# EAGLE design SimpleFMCWRadar-RFBoard (EAGLE 6.5.0)
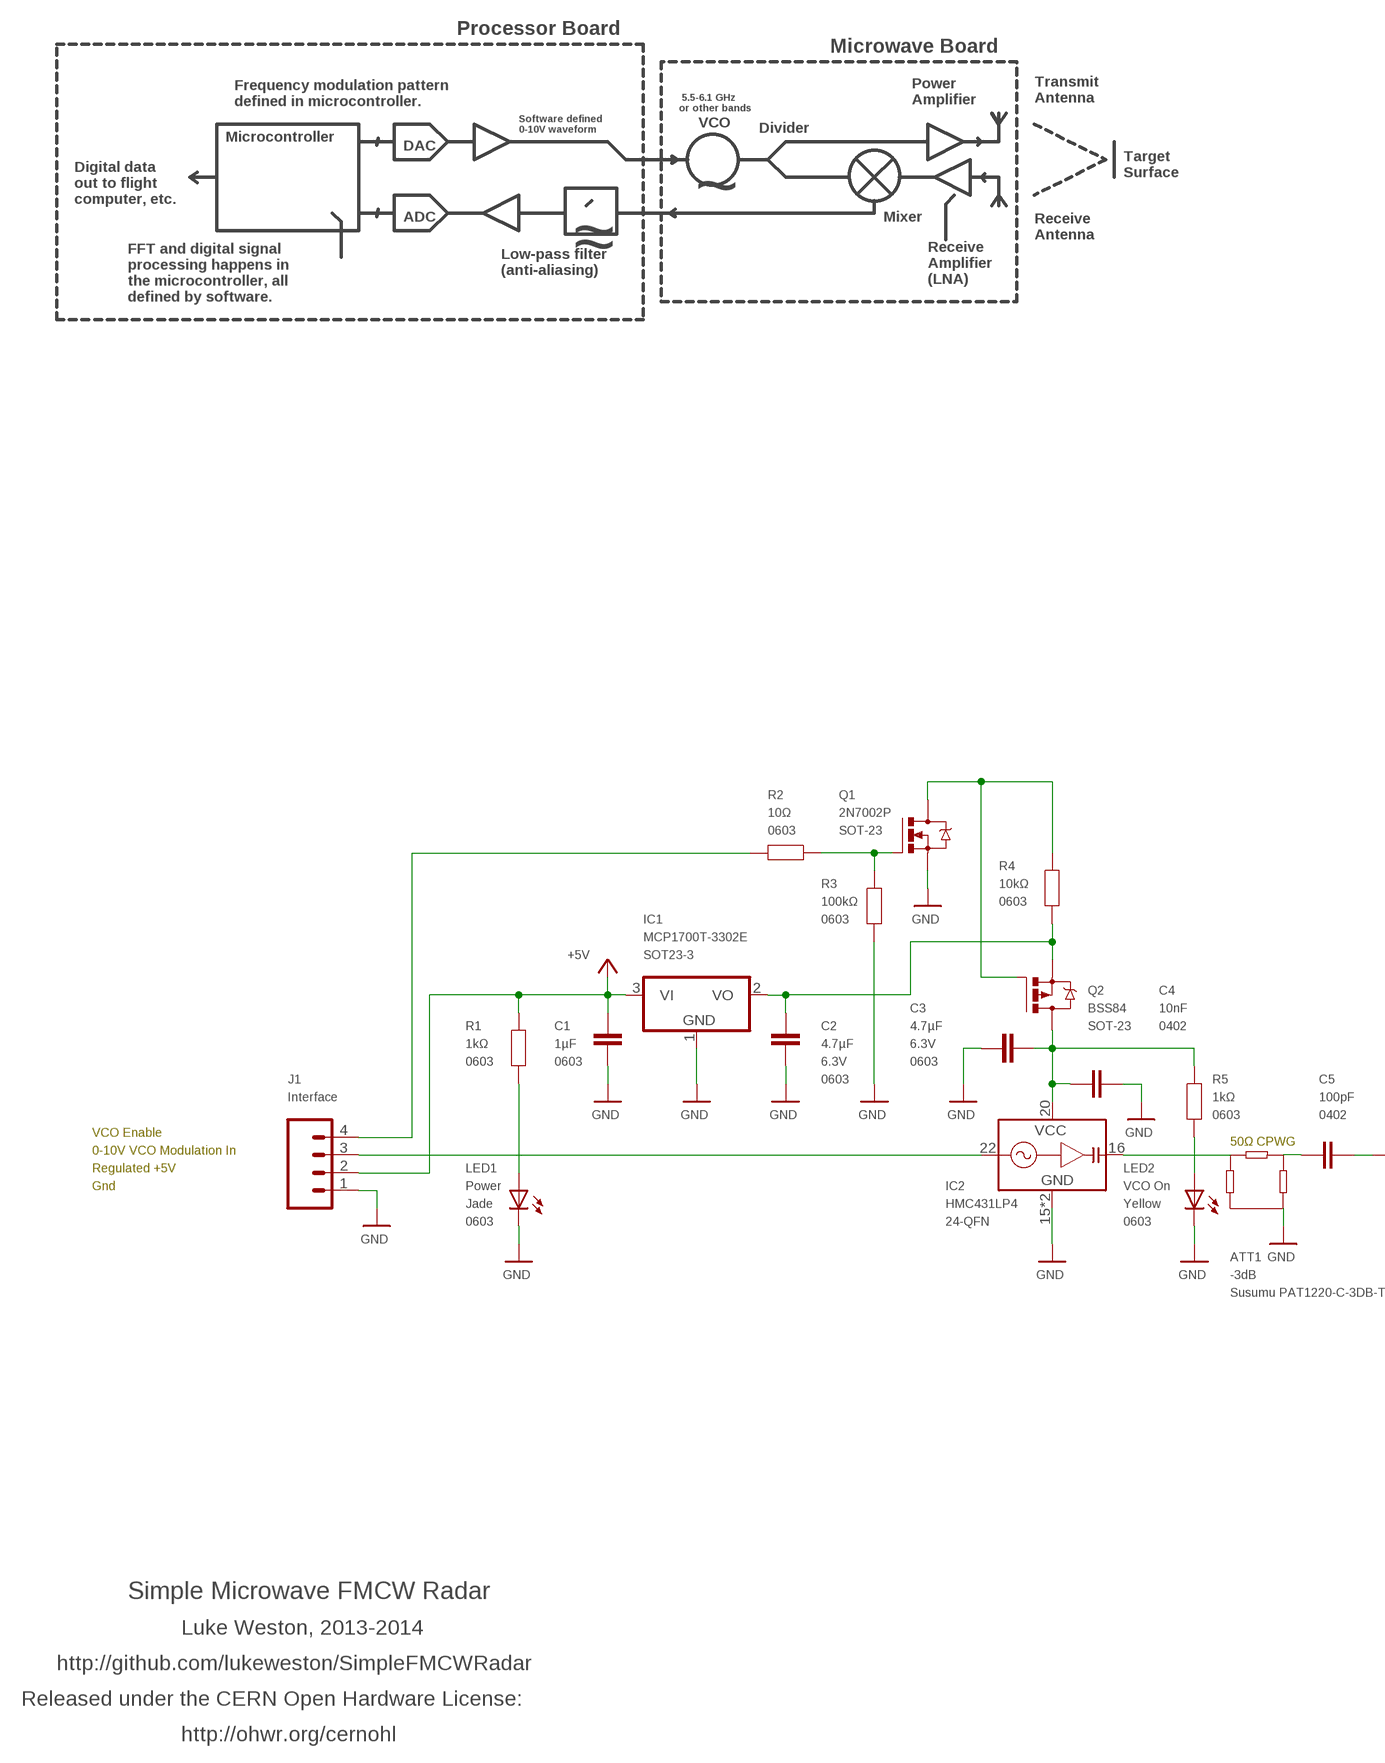
[diagram p0: schematic, sheet 1, part 1 of 2]
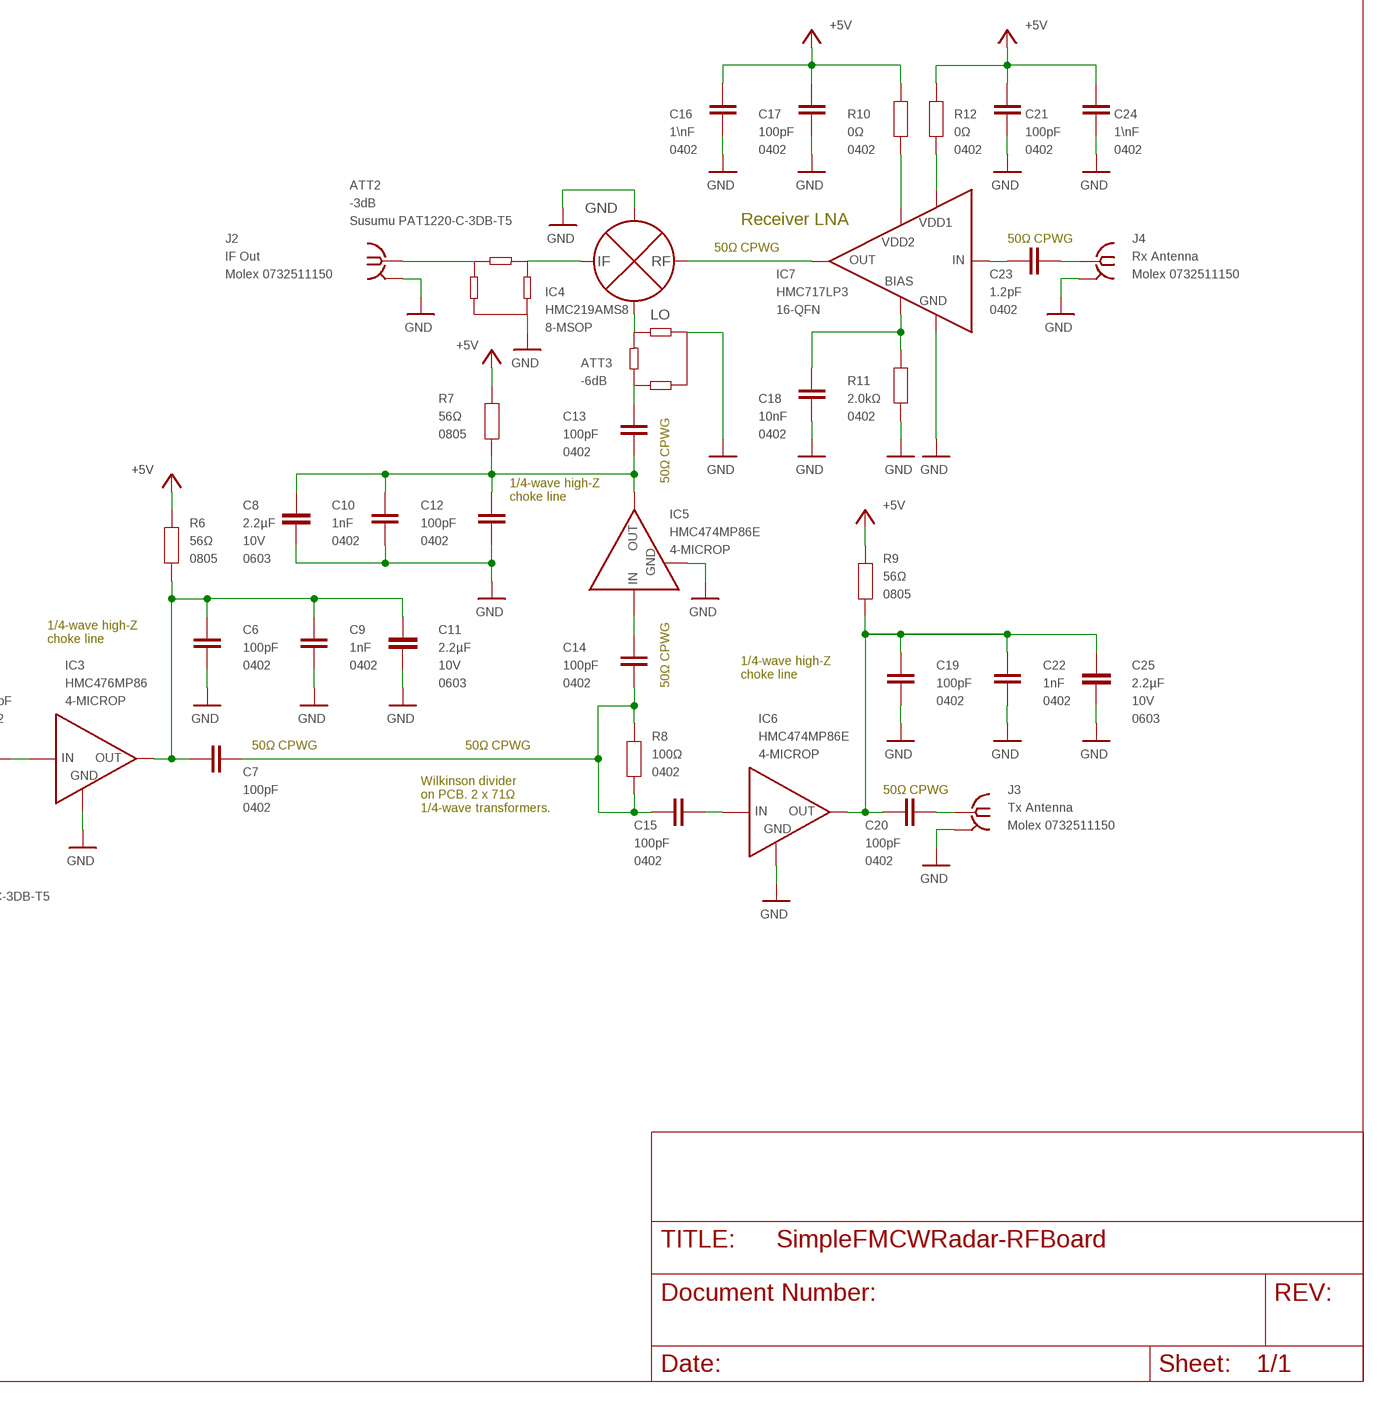
[diagram p1: schematic, sheet 1, part 2 of 2]

## Parts
ATT1  -3dB  PAT1220  [PAT1220]
ATT2  -3dB  PAT1220  [PAT1220]
ATT3  -6dB  PAT1220  [PAT1220]
C1  1µF  CAP0603  [0603]
C2  4.7µF  CAP0603  [0603]
C3  4.7µF  CAP0603  [0603]
C4  10nF  CAPACITOR0402  [0402]
C5  100pF  CAPACITOR0402  [0402]
C6  100pF  CAPACITOR0402  [0402]
C7  100pF  CAPACITOR0402  [0402]
C8  2.2µF  CAP0603  [0603]
C9  1nF  CAPACITOR0402  [0402]
C10  1nF  CAPACITOR0402  [0402]
C11  2.2µF  CAP0603  [0603]
C12  100pF  CAPACITOR0402  [0402]
C13  100pF  CAPACITOR0402  [0402]
C14  100pF  CAPACITOR0402  [0402]
C15  100pF  CAPACITOR0402  [0402]
C16  1\nF  CAPACITOR0402  [0402]
C17  100pF  CAPACITOR0402  [0402]
C18  10nF  CAPACITOR0402  [0402]
C19  100pF  CAPACITOR0402  [0402]
C20  100pF  CAPACITOR0402  [0402]
C21  100pF  CAPACITOR0402  [0402]
C22  1nF  CAPACITOR0402  [0402]
C23  1.2pF  CAPACITOR0402  [0402]
C24  1\nF  CAPACITOR0402  [0402]
C25  2.2µF  CAP0603  [0603]
IC1  MCP1700T-3302E  MCP1703CB  [SOT23]
IC2  HMC431LP4  HMC385LP4  [QFN24]
IC3  HMC476MP86  ERA-2SM+  [WW107]
IC4  HMC219AMS8  [8-MSOP]
IC5  HMC474MP86E  ERA-2SM+  [WW107]
IC6  HMC474MP86E  ERA-2SM+  [WW107]
IC7  HMC717LP3  [16-QFN]
J1  Interface  M04PTH  [1X04]
J2  IF Out  SMA-142-0701-881/886  [J502-ND-142-0701-881/886]
J3  Tx Antenna  SMA-142-0701-881/886  [J502-ND-142-0701-881/886]
J4  Rx Antenna  SMA-142-0701-881/886  [J502-ND-142-0701-881/886]
LED1  Power  LED0603  [LED-0603]
LED2  VCO On  LED0603  [LED-0603]
Q1  2N7002P  2N7002  [SOT23-3]
Q2  BSS84  DMP2035U-7  [SOT23-3]
R1  1kΩ  RESISTOR0603  [0603]
R2  10Ω  RESISTOR0603  [0603]
R3  100kΩ  RESISTOR0603  [0603]
R4  10kΩ  RESISTOR0603  [0603]
R5  1kΩ  RESISTOR0603  [0603]
R6  56Ω  RESISTOR0805  [0805]
R7  56Ω  RESISTOR0805  [0805]
R8  100Ω  RESISTOR-EU0402  [0402]
R9  56Ω  RESISTOR0805  [0805]
R10  0Ω  RESISTOR-EU0402  [0402]
R11  2.0kΩ  RESISTOR-EU0402  [0402]
R12  0Ω  RESISTOR-EU0402  [0402]

## Nets
+5V: C1.2 C16.2 C17.2 C21.2 C24.2 IC1.3(VI) J1.2 R1.2 R6.2 R7.1 R9.1 R10.2 R12.2
GND: ATT1.3 ATT2.3 ATT3.3 C1.1 C2.2 C3.2 C4.2 C6.1 C8.1 C9.1 C10.1 C11.1 C12.1 C16.1 C17.1 C18.1 C19.2 C21.1 C22.2 C24.1 C25.1 IC1.1(GND) IC2.15(GND) IC2.EXP(GND) IC3.2(GND) IC3.4(GND) IC4.1(GND) IC4.3(GND) IC4.6(GND) IC4.8(GND) IC5.2(GND) IC5.4(GND) IC6.2(GND) IC6.4(GND) IC7.P$1(GND) IC7.P$3(GND) IC7.P$4(GND) IC7.P$5(GND) IC7.P$6(GND) IC7.P$7(GND) IC7.P$9(GND) IC7.P$10(GND) IC7.P$12(GND) IC7.P$14(GND) IC7.P$16(GND) IC7.PAD(GND) J1.1 J2.G@1(GND) J3.G@1(GND) J4.G@1(GND) LED1.C LED2.C Q1.2(S) R3.1 R11.1
N$1: C5.2 IC3.1(IN)
N$2: C6.2 C7.1 C9.2 C11.2 IC3.3(OUT) R6.1
N$3: ATT1.2 C5.1
N$4: ATT1.1 IC2.16(RFOUT)
N$6: IC2.22(VTUNE) J1.3
N$7: C15.1 IC6.1(IN)
N$9: C7.2 C14.1 C15.2 R8.1 R8.2
N$10: C20.1 J3.1
N$12: ATT3.2 IC4.2(LO)
N$13: Q1.1(G) R2.1 R3.2
N$14: ATT2.2 IC4.5(IF)
N$15: C23.2 IC7.P$2(IN)
N$16: C23.1 J4.1
N$17: IC4.7(RF) IC7.P$11(OUT)
N$18: C18.2 IC7.P$8(BIAS) R11.2
N$19: IC7.P$13(VDD2) R10.1
N$20: IC7.P$15(VDD1) R12.1
N$21: LED1.A R1.1
N$25: ATT3.1 C13.2
N$27: C3.1 C4.1 IC2.20(VCC) Q2.3(D) R5.2
N$28: C2.1 IC1.2(VO) Q2.2(S) R4.1
N$29: Q1.3(D) Q2.1(G) R4.2
N$30: J1.4 R2.2
N$31: C19.1 C20.2 C22.1 C25.2 IC6.3(OUT) R9.2
N$32: LED2.A R5.1
N$33: C8.2 C10.2 C12.2 C13.1 IC5.3(OUT) R7.2
N$35: C14.2 IC5.1(IN)
N$36: ATT2.1 J2.1

## Notes on the sheet
- Processor Board
- Microwave Board
- Transmit
  Antenna
- Power
  Amplifier
- Frequency modulation pattern
  defined in microcontroller.
- 5.5-6.1 GHz
  or other bands
- VCO
- Software defined
  0-10V waveform
- Divider
- Microcontroller
- DAC
- Target
  Surface
- Digital data
  out to flight
  computer, etc.
- ~
- ADC | Mixer
- Receive
  Antenna
- ~ | ~
- Low-pass filter
  (anti-aliasing)
- Receive
  Amplifier
  (LNA)
- FFT and digital signal
  processing happens in
  the microcontroller, all
  defined by software.
- Receiver LNA
- 50Ω CPWG
- 50Ω CPWG
- 50Ω CPWG
- 1/4-wave high-Z
  choke line
- 1/4-wave high-Z
  choke line
- 1/4-wave high-Z
  choke line
- 50Ω CPWG
- VCO Enable
- 50Ω CPWG | 50Ω CPWG | 50Ω CPWG
- 0-10V VCO Modulation In
- Regulated +5V
- Gnd | 50Ω CPWG
- Wilkinson divider
  on PCB. 2 x 71Ω
  1/4-wave transformers.
- Simple Microwave FMCW Radar
- Luke Weston, 2013-2014
- http://github.com/lukeweston/SimpleFMCWRadar
- Released under the CERN Open Hardware License:
- http://ohwr.org/cernohl

## Power pins joined to a net without a drawn wire
GND: J2.G@2(GND) J2.G@3(GND) J2.G@4(GND) J3.G@2(GND) J3.G@3(GND) J3.G@4(GND) J4.G@2(GND) J4.G@3(GND) J4.G@4(GND)

## Library data of the parts
ATT1 ATT2 = freetronics-luke:PAT1220: Susumu PAT1220 SMD chip attenuator; ID: Susumu PAT1220-C-3DB-T5
ATT3 = freetronics-luke:PAT1220: Susumu PAT1220 SMD chip attenuator
C1 = freetronics-master-v1:CAP: Capacitor Standard 0603 ceramic capacitor, and 0.1" leaded capacitor.; PACKAGE: 0603
C2 C3 = freetronics-master-v1:CAP: Capacitor Standard 0603 ceramic capacitor, and 0.1" leaded capacitor.; PACKAGE: 0603; VOLTAGE: 6.3V
C4-C7 C9 C10 C12-C24 = freetronics-luke:CAPACITOR; PACKAGE: 0402
C8 C11 C25 = freetronics-master-v1:CAP: Capacitor Standard 0603 ceramic capacitor, and 0.1" leaded capacitor.; PACKAGE: 0603; VOLTAGE: 10V
IC1 = linear:MCP1703: 250 mA, 16V, Low Quiescent Current LDO Regulator Source: http://ww1.microchip.com/downloads/en/DeviceDoc/22049b.pdf; PACKAGE: SOT23-3
IC2 = microwave:HMC385LP4: MMIC VCO w/ BUFFER AMPLIFIER, 2.25 - 2.5 GHz Source: http://www.hittite.com/product_info/product_specs/vcos/hmc385lp4.pdf; OC_FARNELL: unknown; OC_NEWARK: unknown; PACKAGE: 24-QFN
IC3 IC5 IC6 = freetronics-luke:ERA-2SM+: Mini-Circuits ERA-2SM+ MMIC amplifier; PACKAGE: 4-MICROP
IC4 = freetronics-luke:HMC219AMS8: Hittite HMC219AMS8 double-balanced microwave mixer; PACKAGE: 8-MSOP
IC7 = freetronics-luke:HMC717LP3: Hittite HMC717LP3 6GHz LNA; PACKAGE: 16-QFN
J1 = freetronics-master-v1:M04: Header 4 Standard 4-pin 0.1" header. Use with straight break away headers (SKU : PRT-00116), right angle break away headers (PRT-00553), swiss pins (PRT-00743), machine pins (PRT-00117), and female headers (PRT-00115). Molex polarized connector foot print use with SKU : PRT-08231 with associated crimp pins and housings.
J2-J4 = con-coax:SMA-: SMA 50 Ohm End Launch Jack Receptacle - Round Contact Johnson Components Source: www.johnsoncomponents.com .. J502-ND.pdf; ID: Molex 0732511150; MF: JOHNSON COMPONENTS; MPN: 142-0701-881; OC_FARNELL: 1608603; OC_NEWARK: 08B906
LED1 = freetronics-master-v1:LED: LEDs Standard schematic elements and footprints for 5mm, 3mm, 1206, and 0603 sized LEDs. 5mm - Spark Fun Electronics SKU : COM-00529 (and others); COLOR: Jade; PACKAGE: 0603
LED2 = freetronics-master-v1:LED: LEDs Standard schematic elements and footprints for 5mm, 3mm, 1206, and 0603 sized LEDs. 5mm - Spark Fun Electronics SKU : COM-00529 (and others); COLOR: Yellow; PACKAGE: 0603
Q1 = freetronics-luke:2N7002: 2N7002 N-ch MOSFET in SOT-23.; PACKAGE: SOT-23
Q2 = freetronics-luke:DMP2035U-7: DMP2035U P-channel MOSFET in SOT-23.; PACKAGE: SOT-23
R1-R5 = freetronics-master-v1:RESISTOR: Resistor Basic schematic elements and footprints for 0603, 1206, and PTH 1/10th watt (small) resistors.; PACKAGE: 0603
R6 R7 R9 = freetronics-master-v1:RESISTOR: Resistor Basic schematic elements and footprints for 0603, 1206, and PTH 1/10th watt (small) resistors.; PACKAGE: 0805
R8 R10-R12 = freetronics-luke:RESISTOR-EU: Chip resistor, EU symbol; PACKAGE: 0402

## Net classes
1 vcc: width 0.254 mm

## Board
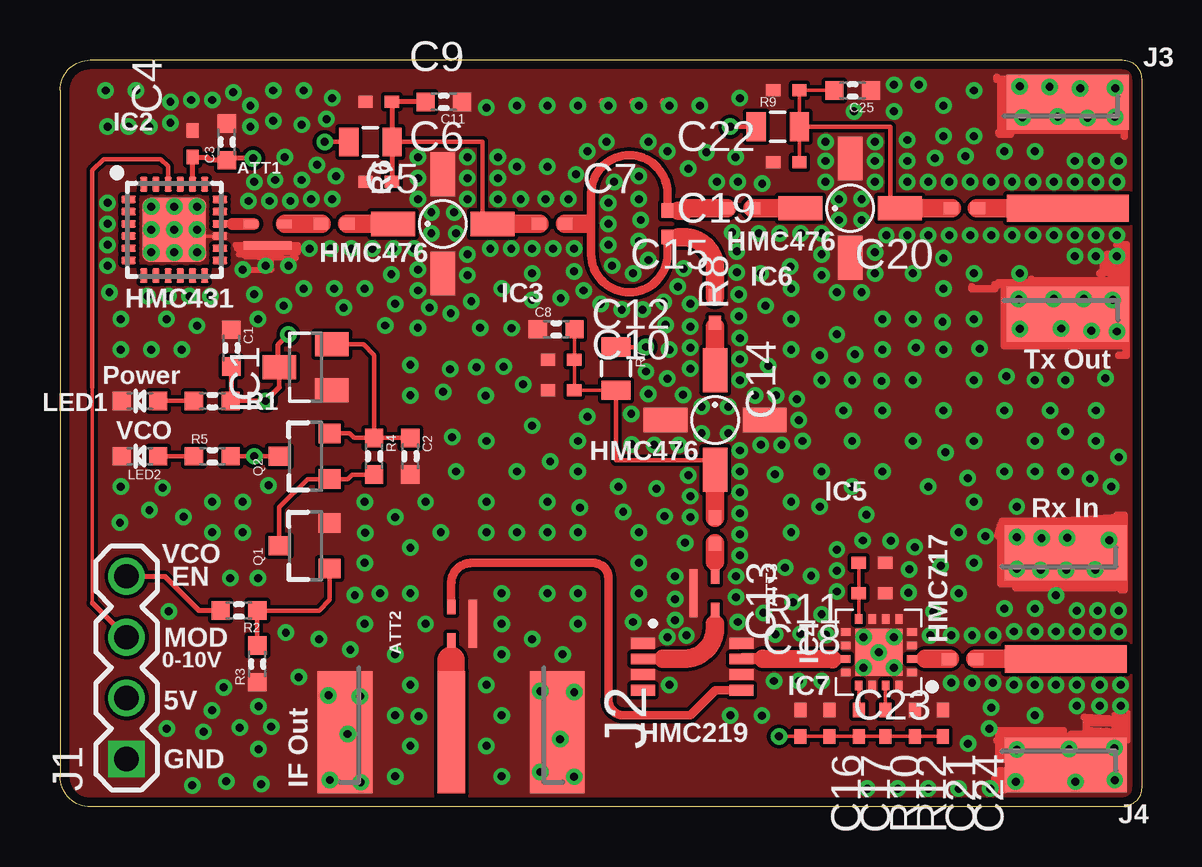
[diagram p2: board, top side]
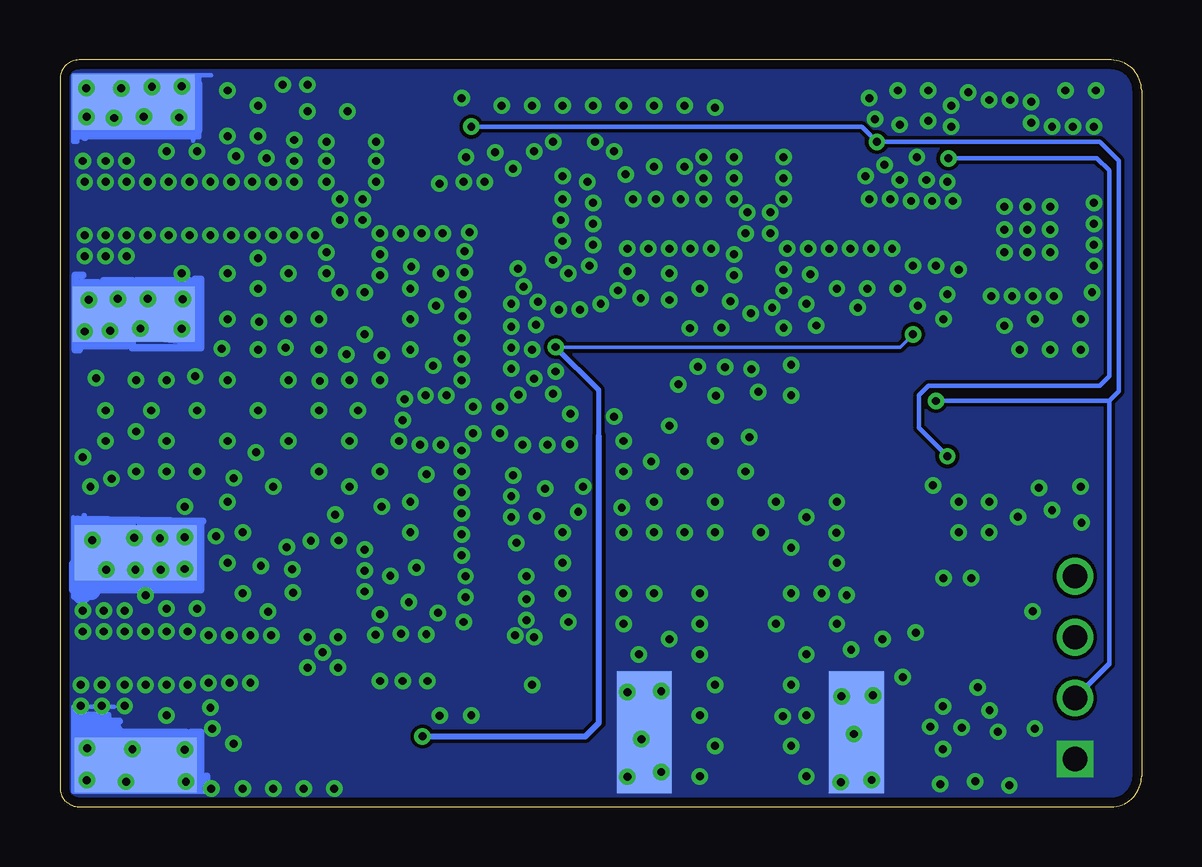
[diagram p3: board, bottom side, seen from below]

Size 45.09 x 31.11 mm. Coordinates in mm from the lower left corner, seen from the top.
Outline: 0,29.84 0,1.27 arc90 1.27,0 44.29,0 arc90 45.09,0.79 45.09,30.32 arc90 44.29,31.11 1.27,31.11 arc90 0,29.84
Copper layers (1*16): Top 0.0356mm / dielectric 1.5011mm / Bottom 0.0356mm
Design rules "LaenPCBOrder *": minimum track width 6mil, minimum drill 13mil, track to track 6mil, track to pad 6mil, pad to pad 6mil, via to via 6mil, smd to smd 6mil, copper to edge 15mil, drill to drill 6mil, minimum pad ring 7mil, minimum via ring 7mil, stop-mask expansion 4mil, vias tented up to drill 16mil, thermal gap 10mil

### Footprints (pad centres in the part's own frame; a part is rotated, then mirrored left to right if it is on the bottom)
PAT1220 = smd 0.6 x 0.35: 1 -0.7,0.45; 2 0.7,0.45 | smd 2 x 0.35: 3 0,-0.45
0603 = smd 0.762 x 0.762: 1 -0.762,0; 2 0.762,0
0402 = smd 0.6 x 0.5: 1 -0.55,0; 2 0.55,0
SOT23 = smd 1 x 1.4: 1 -0.95,-1.1; 2 0.95,-1.1; 3 0,1.1
QFN24 = smd 0.6 x 0.3: 1 -1.905,1.27; 2 -1.905,0.762; 3 -1.905,0.254; 4 -1.905,-0.254; 5 -1.905,-0.762; 6 -1.905,-1.27; 13 1.905,-1.27; 14 1.905,-0.762; 15 1.905,-0.254; 16 1.905,0.254; 17 1.905,0.762; 18 1.905,1.27 | smd 0.3 x 0.6: 7 -1.27,-1.905; 8 -0.762,-1.905; 9 -0.254,-1.905; 10 0.254,-1.905; 11 0.762,-1.905; 12 1.27,-1.905; 19 1.27,1.905; 20 0.762,1.905; 21 0.254,1.905; 22 -0.254,1.905; 23 -0.762,1.905; 24 -1.27,1.905 | smd 2.667 x 2.667: EXP 0,0
WW107 = smd 1.016 x 1.829: 1 0,-2.07; 3 0,2.07 | smd 1.829 x 1.016: 2 2.07,0; 4 -2.07,0
8-MSOP = smd 0.45 x 1: 1 -0.975,-2.05; 2 -0.325,-2.05; 3 0.325,-2.05; 4 0.975,-2.05; 5 0.975,2.05; 6 0.325,2.05; 7 -0.325,2.05; 8 -0.975,2.05
16-QFN = smd 0.305 x 0.406: P$1 -0.838,-1.384; P$2 -0.279,-1.384; P$3 0.279,-1.384; P$4 0.838,-1.384; P$9 0.838,1.384; P$10 0.279,1.384; P$11 -0.279,1.384; P$12 -0.838,1.384 | smd 0.406 x 0.305: P$5 1.384,-0.838; P$6 1.384,-0.279; P$7 1.384,0.279; P$8 1.384,0.838; P$13 -1.384,0.838; P$14 -1.384,0.279; P$15 -1.384,-0.279; P$16 -1.384,-0.838 | smd 1.956 x 1.956: PAD 0,0
1X04 = drill 1.016 square: 1 0,0 | drill 1.016: 2 2.54,0; 3 5.08,0; 4 7.62,0
J502-ND-142-0701-881/886 = smd 5.08 x 1.143: 1 2.565,0 | smd 5.08 x 2.286: G@1 2.565,4.42; G@2 2.565,-4.42 | smd 5.08 x 2.286 bottom: G@3 2.565,4.42; G@4 2.565,-4.42
LED-0603 = smd 0.762 x 0.762: A -0.762,0; C 0.762,0
SOT23-3 = smd 0.8 x 0.9: 1 -0.95,-1; 2 0.95,-1; 3 0,1.1
0805 = smd 0.8 x 1.2: 1 -0.9,0; 2 0.9,0

### Placement (x,y rotation side)
ATT1  8.65,23.84 0 top
ATT2  16.76,7.62 90 top
ATT3  26.86,8.89 270 top
C1  7.14,19.11 270 top
C2  14.61,14.61 270 top
C3  6.95,27.7 90 top
C4  5.52,27.62 90 top
C5  11.43,24.29 0 top
C6  13.29,26.04 0 top
C7  20.52,24.29 0 top
C8  20.68,19.9 0 top
C9  13.29,29.37 0 top
C10  20.9,17.36 0 top
C11  16,29.37 180 top
C12  20.9,18.63 0 top
C13  27.3,11.51 270 top
C14  27.3,20.72 270 top
C15  28.34,24.94 180 top
C16  30.86,3.48 270 top
C17  32.08,3.48 270 top
C18  33.84,8.89 180 top
C19  30.27,26.86 180 top
C20  37.7,24.94 180 top
C21  35.64,3.48 270 top
C22  30.27,29.84 180 top
C23  37.62,6.16 180 top
C24  36.8,3.48 270 top
C25  33.04,29.84 180 top
IC1  10.24,18.31 90 top
IC2  4.76,24.03 0 top
IC3  15.95,24.29 270 top
IC4  26.35,5.83 270 top
IC5  27.3,16.11 180 top
IC6  32.94,24.94 270 top
IC7  34.13,6.44 90 top
J1  2.78,1.98 90 top
J2  16.31,5.68 270 top
J3  39.45,24.94 0 top
J4  39.37,6.16 0 top
LED1  3.33,16.91 180 top
LED2  3.33,14.61 180 top
Q1  10.24,10.87 90 top
Q2  10.24,14.61 90 top
R1  6.35,16.91 0 top
R2  7.46,8.18 180 top
R3  8.22,5.95 90 top
R4  13.1,14.61 270 top
R5  6.35,14.61 0 top
R6  12.94,27.7 180 top
R7  23.18,18.26 270 top
R8  25.32,24.29 270 top
R9  29.92,28.34 0 top
R10  33.29,3.48 270 top
R11  33.84,10.16 180 top
R12  34.41,3.48 270 top

### Tracks (layer width: path | path; a pad name or v marks a point on that pad's centre or on a via)
+5V  (via drill 0.33)
  Top 0.152: C24.2 C21.2 R12.2 R10.2 C17.2 C16.2 v29.97,2.93
  Top 0.178: R9.1 v27.94,28.34 | R7.1 v24.42,19.16 | R6.2 v11.03,27.7 | 9.14,17.47 IC1.3 9.1,18.35 | R1.2 v8.57,16.91
  Top 0.203: v8.57,16.91 9.14,17.47 | 9.1,18.35 9.1,19.26 v9.53,19.68 | C1.2 7.14,16.94 R1.2
  Bottom 0.152: v24.42,19.16 10.05,19.16 v9.53,19.68
  Bottom 0.178: v27.94,28.34 11.67,28.34 v11.03,27.7 1.75,27.7 0.95,26.91 0.95,17.3 1.35,16.91 | v8.57,16.91 1.35,16.91 | 1.35,5.95 1.35,16.91
  Bottom 0.203: 1.35,5.95 J1.2 | 22.62,15.45 22.62,17.36 v24.42,19.16
  Bottom 0.254: 22.62,15.45 22.62,3.49 23.18,2.93 v29.97,2.93
GND  (via drill 0.33)
  Top 0.152: IC2.15 5.71,23.78 5.71,24.04 IC2.EXP
  Top 0.178: 43.32,2.31 44.01,3.1 44.01,3.85 43.93,3.85 43.93,3.29 | 42.78,3.29 42.78,3.33 | 44.53,3.93 44.53,2.74
  Top 0.254: 7.3,23.42 8.65,23.42 | 8.65,23.42 9.92,23.42 9.92,23.1 9.68,23.1 | 9.68,23.1 9.13,23.1 9.13,22.94 8.81,22.94 | 8.81,22.94 8.81,23.02 | 8.81,23.02 8.81,23.18 9.68,23.18 9.68,23.26 7.46,23.26 | 7.38,23.26 7.46,23.26 | 7.46,23.26 7.46,23.02 8.57,23.02 | 8.65,23.02 8.57,23.02 | 8.57,23.02 8.57,23.18 | 8.57,23.18 7.54,23.18 7.7,22.94 9.84,22.86 9.68,23.1 | v7.62,22.38 8.81,22.38 8.81,22.94 | 8.81,23.02 8.65,23.02 | 8.65,23.02 ATT1.3 | ATT1.3 8.65,23.42 | ATT1.3 8.57,23.39 8.57,23.18
  Top 0.305: 39.05,30.4 39.05,30.32 39.53,30.32 39.53,30.16 39.29,30.16 | 39.29,30.16 39.29,29.61 | 39.29,29.61 39.37,29.61 arc-90 39.45,29.53 | 39.45,29.53 39.45,30 | 39.45,29.53 39.45,28.18 arc90 39.61,28.02 39.21,28.02 arc-90 39.13,28.1 39.21,28.1 arc90 39.29,28.18 | 39.29,28.18 39.29,29.61 | 39.29,30.16 arc90 39.21,30.24 39.21,28.26 arc90 39.29,28.18 | 39.29,28.18 44.37,28.18 44.37,27.94 | 44.29,21.59 44.37,21.59 44.37,21.91 | 44.37,21.91 44.37,21.99 | 44.37,21.99 44.13,21.99 44.13,21.67 44.05,21.67 44.05,21.91 42.39,21.91 | 42.39,21.91 42.39,21.67 43.89,21.67 43.89,21.75 41.99,21.75 41.99,21.83 42.07,21.83 42.07,21.91 | 42.07,21.91 42.39,21.91 | 42.07,21.91 40.56,21.91 40.56,21.75 42.07,21.75 42.07,21.59 39.37,21.59 39.37,19.21 44.37,19.21 44.37,19.45 44.13,19.45 44.13,19.29 40.64,19.29 40.64,19.45 | 40.48,21.83 39.13,21.83 39.13,21.75 38.97,21.75 38.97,21.59 38.02,21.59 38.02,21.67 | 40.48,21.83 40.48,21.99 | 40.48,21.83 40.48,21.67 | 43.66,23.02 44.37,23.02 44.37,21.99 | 44.37,21.91 43.89,21.91 43.89,22.78 44.13,22.78 44.13,22.15 | 43.42,22.15 43.42,22.23 43.34,22.23 | 43.34,22.78 43.74,22.78 43.74,22.23 | 43.5,22.23 43.5,22.62 | 44.05,23.42 44.45,23.42 44.45,23.18 | 44.37,23.1 44.45,23.1 | 44.21,22.54 44.45,22.54 | 44.45,22.54 44.45,21.99 | 43.58,22.46 44.29,22.46 44.29,21.99 | 44.45,21.99 44.29,21.99 | 44.29,21.99 44.29,21.83 | 44.45,23.1 44.45,22.54 | 44.13,23.18 44.45,23.18 | 44.45,23.18 44.45,23.1 | 44.13,18.81 44.45,18.81 44.45,21.99 | 44.05,22.07 44.05,21.19 | 44.05,12.14 44.37,12.14 44.37,10.64 44.13,10.64 44.13,12.06 39.21,11.75 39.09,11.29 43.85,11.29 43.89,11.91 39.29,11.91 39.29,11.59 39.37,11.59 39.37,11.67 43.74,11.67 43.74,11.59 44.37,11.59 44.37,9.05 44.21,9.05 44.21,9.45 39.85,9.45 39.85,9.13 43.97,9.13 43.97,9.21 40.01,9.21 40.01,9.29 39.21,9.29 39.21,11.19 39.37,11.19 39.37,9.37
  Top 0.305: 43.58,3.57 44.29,3.57 | 44.29,3.57 44.29,2.94 | 44.29,2.94 44.29,2.14 44.05,2.14 | 44.13,3.1 44.13,3.02 42.15,3.02 42.15,2.94 39.77,2.94 39.77,3.17 | 39.77,3.17 41.83,3.17 | 39.77,3.17 39.13,3.17 39.13,2.86 | 39.13,2.86 39.13,1.98 39.29,1.98 39.29,3.02 39.53,3.02 39.53,2.86 39.13,2.86 | 39.13,2.86 39.05,2.78 | 39.13,1.19 38.97,1.19 38.97,1.03 | 38.97,1.03 38.97,0.79 39.13,0.79 | 39.13,0.79 39.45,0.79 | 38.97,1.03 39.29,1.03 | 39.37,1.03 39.29,1.03 | 39.29,1.03 39.29,1.51 39.21,1.51 | 39.13,1.51 39.21,1.51 | 39.21,1.51 39.21,1.27 | 39.37,0.71 39.13,0.71 39.13,0.79 | 42.7,3.73 44.13,3.65 | 44.21,3.73 44.29,3.73 44.29,3.57 | 44.29,2.94 44.21,2.94 44.21,3.73 | 44.21,3.73 44.13,3.65 | 44.13,3.65 44.13,3.1 | 44.13,3.1 43.02,3.17 | 43.02,3.17 42.78,3.17 42.78,3.33 42.78,3.49 43.97,3.49 | 44.37,3.17 44.37,2.94 43.02,2.94 43.02,3.17 | 44.37,3.17 44.37,3.73 | 44.13,2.38 44.05,2.38 44.13,3.1 | 44.37,3.17 44.13,3.17 | 22.62,29.37 22.7,29.37 | 23.89,29.37 23.97,29.37 | 25.16,29.37 25.24,29.37
  Top 0.406: 43.18,2.54 42.86,2.54 42.86,3.13 v43.95,2.44 43.32,2.31 43.62,3.1 43.62,2.54 43.66,2.54
  Bottom 0.178: 42.82,4.17 44.53,4.17 44.53,0.64 38.81,0.64 39.08,0.98 43.06,1.02 42.78,2.66 42.78,3.41 44.09,3.41 44.09,3.21 42.98,3.21 42.98,3.33 | 44.05,12.14 44.09,12.14 44.09,11.75 44.53,11.75 | 44.53,11.75 44.53,12.06 | 44.53,11.75 44.53,10.12 | 44.53,9.09 44.53,8.73 | 44.13,11.83 44.13,11.91 44.05,11.91 43.74,11.59 43.74,10.64 43.5,10.4 43.5,10.72 42.86,11.35 42.86,9.45 43.26,9.05 | 44.09,3.33 44.09,3.89 44.13,3.89 | 44.13,3.13 v43.95,2.44 42.82,3.1 | 38.77,30.48 44.53,30.48 44.53,27.7 44.37,27.7 44.37,28.22 39.49,28.22 39.49,30.4 39.29,30.4 39.29,27.9 44.25,27.9 44.25,28.18 39.45,28.18 39.41,28.18 39.41,27.98 | 44.09,27.98 44.09,28.14 39.37,28.14 | 39.37,29.96 39.53,29.96 39.53,27.74
  Bottom 0.305: 38.97,1.27 38.97,0.87 39.05,0.87 | 39.05,0.87 39.29,0.87 39.29,0.79 | 39.29,0.79 39.37,0.79 | 39.29,0.79 39.21,0.79 | 39.13,0.79 39.21,0.79 | 39.21,0.79 39.21,3.1 39.37,3.1 | 39.61,3.1 39.37,3.1 | 39.37,3.1 39.37,1.03 39.45,1.03 39.45,2.94 44.29,2.94 | 42.78,3.57 44.29,3.57 44.29,3.81 | 42.62,3.57 42.78,3.57 | 42.78,3.57 42.78,3.41 42.78,3.25 44.05,3.25 44.05,3.41 43.1,3.41 | 39.85,3.1 42.55,3.1 43.34,2.9 42.43,2.9 42.7,3.33 42.86,3.33 42.86,3.41 43.1,3.41 | 39.05,0.87 39.05,0.71 39.37,0.71 | 43.1,3.41 43.1,3.81 44.29,3.81 | 44.37,3.81 44.29,3.81 | 44.29,3.81 44.29,3.89 44.37,3.89 44.37,3.81 | 44.37,3.81 44.37,2.94 | 39.13,11.91 44.37,11.99 44.37,9.05 44.13,9.05 43.26,9.05 39.21,9.05 39.21,11.83 39.45,11.83 | 41.75,11.83 39.45,11.83 | 39.45,11.83 39.45,9.29 44.13,9.29 | 44.13,11.83 42.07,11.83 42.07,11.67 | 44.13,22.15 44.45,22.15 44.45,21.43 44.21,21.43 44.21,21.83 43.5,21.83 43.5,21.75 43.97,21.75 43.97,21.67 44.45,21.67 44.45,19.05 44.29,19.05 44.29,19.29 43.02,19.29 43.02,19.21 | 43.02,19.21 44.13,19.21 | 43.02,19.21 42.31,19.21 42.31,19.29 42.78,19.29 42.78,19.37 42.07,19.37 42.07,19.13 39.21,19.13 39.21,21.99 39.45,21.99 39.45,19.21 39.61,19.21 39.61,19.37 41.82,19.62 41.91,21.91 39.69,21.91 39.69,21.75 43.26,21.75 43.26,21.91 42.07,21.91 42.07,21.83
  Bottom 0.356: 44.21,10.04 44.49,10.04 44.53,10.12 44.53,9.09 44.53,9.05 44.37,9.05
  Bottom 0.406: 43.18,2.54 42.74,2.54 42.74,3.21 43.46,3.21 43.46,3.06 42.78,3.06 42.78,2.66 | 39.45,30 39.41,30 | 39.41,30 39.41,29.33 | 39.41,30 39.41,30.16 39.37,30.16 39.37,28.14 39.45,28.14 39.45,28.18 39.65,28.18 39.65,28.02 44.05,28.02 44.05,27.94
  Bottom 0.762: 43.77,9.01 44.17,9.01 | 44.17,9.01 44.17,8.81 | 44.17,9.01 44.13,9.05
  other vias: 1.98,25.16 1.98,24.29 1.98,23.42 1.98,22.54 42.31,26.04 43.18,26.04 44.05,26.04 41.43,26.04 33.42,25.32 32.46,25.32 31.91,26.04 32.46,24.45 33.42,24.45 33.97,23.1 36.2,23.81 37.07,23.81 7.86,25.24 8.1,21.35 6.27,21.27 33.97,22.23 30.88,23.89 31.75,23.89 31.91,26.91 31.75,23.02 30,23.89 31.75,22.15 23.1,26.04 24.13,26.27 36.2,26.04 22.86,24.29 22.86,25.16 22.86,23.42 23.02,22.54 5.4,21.27 40.56,23.81 39.69,23.81 38.81,23.81 37.94,23.81 24.13,23.57 24.53,22.78 23.89,22.23 24.13,25.32 24.21,24.45 28.22,23.14 30.44,22.5 26,22.42 27.38,26.04 26.19,26.59 40.56,26.04 39.69,26.04 38.81,26.04 41.43,23.81 42.31,23.81 43.18,23.81 29.13,23.89 37.07,26.04 28.26,26.04 37.94,26.04 28.02,23.93 44.05,23.81 25.16,21.03 25.76,21.67 3.65,21.27 4.52,21.27 8.73,25.24 8.57,22.54 9.6,25.24 24.29,20.72 23.42,20.72 22.78,27.7 24.53,27.7 25.32,27.3 11.35,25.32 9.53,22.54 10.48,25.32 10.4,23.26 12.14,23.26 11.27,23.26 13.89,23.26 13.02,23.26 19.21,25.32 20.24,25.32 21.19,25.32 16.99,25.32 18.26,26.19 21.99,27.3 16.99,27.07 14.92,26.19 15.48,24.77 19.68,23.26 20.56,23.26 21.43,23.26 17.94,23.26 21.43,22.3 16.99,23.02 17.14,21.05 21.83,21.51 16.51,23.89 16.43,24.77 18.26,25.32 22.54,20.95 15.48,23.89 14.76,23.26 14.92,22.38 14.92,25.32 14.92,27.07 16.99,26.19 33.5,7.06 33.5,5.79 34.13,6.43 34.77,7.06 21.67,12.46 34.77,5.79 36.27,7.14 37.15,7.14 37.15,5.16 36.91,14.76 32.38,9.84 38.02,7.14 38.89,7.14 39.77,7.3 38.89,5.16 38.02,5.16 41.51,7.3 40.64,7.3 40.64,5.08 39.77,5.08 41.51,5.08 42.39,7.3 43.26,7.3 43.34,5.08 42.39,5.08 44.13,7.3 44.21,5.08 5.71,24.05 4.76,24.05 4.76,23.1 3.81,25 5.71,25 5.71,23.1 4.76,25 3.81,24.05 3.81,23.1 2.06,21.43 6.35,29.45 7.22,29.77 5.48,29.45 1.98,28.34 8.1,26.04 4.6,28.5 4.6,29.37 2.86,28.34 3.73,28.34 42.31,26.91 44.13,26.91 43.18,26.91 43.18,22.94 44.05,22.94 42.31,22.94 42.39,4.21 43.34,4.21 44.21,4.21 29.84,17.14 34.45,23.81 35.32,26.91 35.32,27.78 33.47,11.09 35.32,26.04 35.32,23.81 35.63,10.82 33.62,12.17 35.4,9.89 32.38,10.72 34.63,11.08 44.13,8.18 43.26,8.18 42.39,8.18 31.93,7.16 32.38,8.97 35.37,8.92 36.41,8.13 38.81,4.13 38.73,3.25 37.85,2.63 14.92,21.51 29.82,7.18 30.87,7.21 30.8,5.24 29.77,5.24 31.75,5.24 18.81,23.26 15.4,20.8 16.29,20.56 16.99,22.15 25.64,7.78 25.64,8.65 29.33,8.08 28.26,7.7 28.18,8.73 23.89,7.7 31.75,8.02 11.35,29.53 11.11,28.65 10.72,26.75 17.78,29.13 11.51,26.27 18.26,27.07 21.51,26.35 24.43,18.14 25.32,17.84 26.75,16.67 25.98,17.16 26.27,18.26 28.34,19.53 28.22,22.26 28.3,21.35 28.3,20.44 26.27,20 27.86,16.67 28.97,17.14 30.72,16.99 30.8,16.11 26.75,15.56 23.81,16.37 23.83,15.1 26.27,19.13 27.86,15.56 28.34,17.78 28.34,18.65 26.27,20.95 25.8,15.08 24.77,15.08 28.34,14.84 29.21,15.08 30.08,15.08 30.96,15.24 26.27,12.06 28.34,13.97 28.34,13.1 28.34,11.35 28.34,12.22 26.05,10.99 23.48,12.28 25.64,9.6 28.34,10.48 28.18,9.6 33.97,27.7 33.97,26.91 33.97,26.04 31.91,27.7 25.32,7.06 26.11,7.14 9.37,27.07 7.94,28.34 7.94,29.21 25.24,20.08 25.4,19.05 24.53,17.2 20.88,21.19 19.68,21.11 18.49,18.34 8.89,28.57 8.97,26.11 10.08,26.11 10.08,28.42 28.16,27.07 28.34,29.53 33.1,28.97 26.19,13.81 26.27,12.94 32.38,21.43 33.42,21.43 34.77,28.97 34.77,30.08 24.86,13.26 7.62,12.7 17.78,12.7 20.32,12.7 30.48,12.7 30.22,9.97 35.56,20.32 38.1,20.32 33.02,17.78 33.02,15.24 35.56,15.24 38.1,12.7 38.1,15.24 35.56,17.78 40.64,15.24 38.1,17.78 43.18,15.24 12.7,10.16 12.7,21.59 16.26,18.23 23.28,13.34 24.13,11.43 24.13,10.16 24.13,8.89 21.59,13.97 17.78,15.24 15.24,12.7 12.7,12.7 7.62,11.43 14.92,19.96 10.16,21.59 2.54,19.05 3.81,19.05 6.35,12.7 6.35,11.43 6.83,4.97 5.08,19.05 11.43,21.59 18.41,21.59 38.1,10.16 36.83,27.94 19.05,29.21 20.32,29.21 21.59,29.21 22.86,29.21 24.13,29.21 26.67,29.21 25.4,29.21 19.05,26.67 20.32,26.67 30.48,19.05 30.48,21.59 12.7,7.62 6.93,1.06 36.83,29.21 41.59,28.75 42.83,28.7 36.83,22.86 40.01,19.91 34.29,19.05 43,19.83 41.91,17.78 40.64,17.78 40.88,9.87 43.15,9.88 40.64,13.97 43.81,13.34 39.84,1.05 42.33,1.04 43.97,1.11 40.64,3.81 41.98,11.2 34.29,13.97 25.4,5.08 8.26,9.53 10.79,6.99 13.97,6.35 12.51,4.6 11.2,4.64 11.25,1.12 12.54,1.02 14.61,5.08 17.78,5.08 20.02,4.82 20.85,2.82 21.44,4.77 21.43,1.25 20.02,1.45 27.94,3.81 17.78,2.54 18.41,3.81 18.41,1.27 13.97,3.81 18.41,6.35 14.61,2.54 13.97,1.27 5.98,3.13 8.27,4.18 9.42,7.25 15.24,7.62 20.32,11.43 5.15,12.08 14.61,10.79 30.48,11.43 20.32,8.89 19.68,6.99 18.41,7.62 18.41,8.89 19.05,11.43 21.59,11.43 21.59,7.62 21.59,8.89 15.88,11.43 14.61,8.89 33.02,13.34 19.05,13.97 16.51,13.97 29.21,22.23 32.38,19.68 31.75,17.78 34.29,20.32 36.83,19.05 30.54,8.52 31.75,13.97 34.29,16.51 36.83,16.51 36.2,13.34 37.47,11.43 37.47,8.89 39.37,8.26 40.64,8.26 41.91,13.97 39.37,13.97 38.1,22.23 36.83,21.59 40.01,22.23 35.56,22.23 39.37,16.51 41.27,16.51 43.18,16.51 2.54,20.32 1.91,29.84 8.89,29.84 10.16,29.84 3.17,29.84 40.01,30.02 38.1,29.84 38.1,27.94 39.37,27.3 40.64,27.3 4.45,20.32 8.26,20.32 14.61,17.14 13.97,12.06 17.78,11.43 13.34,8.89 7.1,9.53 2.5,11.84 2.54,13.34 4.28,13.29 6.34,4.02 20.95,6.35 19.68,15.88 17.36,18.32 15.97,17.28 14.61,18.41 13.97,20.95 17.75,17.13 19.68,22.23 21.59,15.24 33.66,0.75 34.92,0.75 36.2,0.75 37.47,0.75 38.77,0.75 30.48,20.32 29.53,18.38 34.25,17.74 29.81,13.85 32.66,16.51 38.34,19.09 39.97,21.15 36.79,20.2 42.67,21.16 43.58,17.86 39.45,17.94 39.89,12.5 39.89,11.23 39.89,9.91 38.58,11.27 43.74,11.11 41.73,19.93 43.88,21.12 41.94,9.87 41.51,8.81 36.71,10.04 42.94,13.67 37.84,13.69 20.44,14.39 16.35,15.4 35.68,19.13 41.42,21.16 29.41,20.88 31.67,18.81 33.14,18.85 44.05,19.8 41.91,15.64 40.92,11.19 9.96,5.4 8.81,3.33 14.95,3.77 7.5,3.29 8.27,2.4 5.51,0.89 4.53,8.14 44.13,14.57 35.8,30.08 36.47,27.03 37.74,27.11 26.95,27.27 18.83,19.94 13.81,22.19 11.83,20.8 9.33,20.88 5.71,20.04 39.89,2.38 42.06,2.4 25.2,12.1 31.67,12.5 40.12,28.72 41.25,29.99 43.99,29.94 42.53,29.93 43.97,28.74 12.29,8.82 12.72,11.41 4.45,3.25 3.73,12.36 8.69,13.39 17.51,19.96 21.99,16.25 19.31,17.6 13.56,20.05 29.27,25.97 31.31,9.62 29.26,3.8 12.1,6.55 8.39,0.94
  pour Top (isolate 0.152, no thermals): -0.64,31.75 45.8,31.75 45.8,-0.64 -0.64,-0.64
  pour Bottom (isolate 0.152, no thermals): -0.64,31.75 45.8,31.75 45.8,-0.64 -0.64,-0.64
N$1
  Top 0.406: C5.2 11.96,24.29
  Top 0.762: 11.96,24.29 IC3.1
N$2
  Top 0.178: 18.65,24.13 18.18,24.13 IC3.3 | 17.62,24.21 17.62,27.7 R6.1
  Top 0.203: 18.65,24.13 arc90 18.49,24.29 IC3.3 | C7.1 19.99,24.29 | C6.2 R6.1 C9.2 C11.2
  Top 0.762: IC3.3 | IC3.3 17.62,24.21 | 19.99,24.29 IC3.3
N$3
  Top 0.356: ATT1.2 9.39,24.29
  Top 0.762: 9.39,24.29 C5.1 10.9,24.29
N$4
  Top 0.279: 7.58,24.29 ATT1.1
  Top 0.305: IC2.16 7.18,24.29
  Top 0.508: 7.18,24.29 7.58,24.29 8.07,24.29
N$5
  Top 0.152: 21.91,24.37 arc90 21.99,24.45 | 21.99,24.45 21.99,24.61 | 21.99,24.45 22.01,23.97
N$6
  Top 0.152: 1.35,17.46 1.35,8.49
  Top 0.178: 1.35,17.46 1.35,26.51 1.83,26.99 4.21,26.99 4.51,26.69 IC2.22
  Top 0.203: 1.35,8.49 J1.3
N$7
  Top 0.152: C15.1 28.87,24.94 | IC6.1 30.07,24.94
  Top 0.762: 30.07,24.94 28.87,24.94
N$9
  Top 0.152: 25.32,25.56 25.32,25.72 | 22.15,24.2 21.91,24.29 21.67,24.53 22.07,24.53 | 27.81,24.94 C15.2
  Top 0.203: C7.2 21.05,24.29 | R8.2 25.79,23.74 | R8.1 25.79,24.84
  Top 0.33: 25.32,22.86 25.32,23.02 arc-90 23.73,21.43
  Top 0.356: R8.2 25.32,23.02 arc-90 23.73,21.43 arc-90 22.15,23.02 22.15,24.2 22.15,25.56 arc-90 23.73,27.15 arc-90 25.32,25.56 R8.1
  Top 0.762: 21.05,24.29 21.91,24.29 | 25.79,23.74 25.99,23.74 arc-90 27.3,22.42 C14.1 27.3,21.25 | 25.79,24.84 26.03,24.84 26.13,24.94 27.81,24.94
N$10
  Top 0.152: J3.1 39.85,24.94 | C20.1 38.58,24.94 38.23,24.94
  Top 0.762: 38.23,24.94 39.85,24.94
N$11
  Bottom 0.762: 44.17,9.8 44.13,9.8 44.13,9.37
N$12
  Top 0.33: ATT3.2 27.3,7.62
  Top 0.432: IC4.2 25.13,6.16
  Top 0.762: 25.13,6.16 26,6.16 arc90 27.3,7.46 27.3,7.62
N$13
  Top 0.178: Q1.1 11.24,8.62 10.79,8.18 R2.1 R3.2
N$14
  Top 0.356: IC4.5 27.32,4.86 26.27,3.81 23.5,3.81 arc-90 22.86,4.45 22.86,9.53 arc90 22.23,10.16 17.14,10.16 arc90 16.31,9.33 ATT2.2
N$15
  Top 0.152: IC7.P$2 36.07,6.16 | C23.2 36.83,6.16 37.09,6.16
  Top 0.762: 36.07,6.16 37.09,6.16
N$16
  Top 0.152: C23.1 38.25,6.16 38.15,6.16
  Top 0.762: 38.15,6.16 J4.1
N$17
  Top 0.178: IC7.P$11 32.19,6.15
  Top 0.457: 29.31,6.16 IC4.7
  Top 0.762: 32.19,6.15 29.31,6.16
N$18
  Top 0.152: R11.2 C18.2 IC7.P$8
N$19
  Top 0.152: IC7.P$13 R10.1
N$20
  Top 0.152: IC7.P$15 R12.1
N$21
  Top 0.178: LED1.A R1.1
N$25
  Top 0.33: 27.3,10.2 ATT3.1
  Top 0.762: 27.3,10.98 C13.2 27.3,10.2
N$27  (via drill 0.33)
  Top 0.178: R5.2 v8.1,14.61 Q2.3
  Top 0.203: v8.05,27.02 7.03,27.02 C3.1 6.27,26.94 6.14,27.07 C4.1 IC2.20
  Bottom 0.178: v8.05,27.02 1.86,27.02 1.35,26.51 1.35,17.94 1.75,17.54 8.89,17.54 9.29,17.14 9.29,15.8 v8.1,14.61
N$28
  Top 0.178: Q2.2 12.06,15.56 12.26,15.37 R4.1 | 13.18,15.45 R4.1 | R4.1 13.1,18.81 12.65,19.26 IC1.2 | C2.1 R4.1
N$29
  Top 0.178: Q1.3 9.14,12.47 10.32,13.65 Q2.1 11.99,13.65 12.18,13.84 R4.2
N$30
  Top 0.203: R2.2 5.79,8.18 4.37,9.6 J1.4
N$31
  Top 0.152: 35.64,24.77 arc90 35.53,24.91 | C20.2 36.99,24.94 37.17,24.94 | C19.1 R9.2 C22.1 C25.2
  Top 0.178: R9.2 34.61,28.34 34.61,25.32 35.01,25.32 IC6.3 35.01,24.92
  Top 0.203: 35.64,24.77 arc90 35.48,24.92 35.01,24.92
  Top 0.762: IC6.3 37.17,24.94
N$32
  Top 0.178: LED2.A R5.1
N$33
  Top 0.152: R7.2 C10.2 C12.2 C8.2
  Top 0.178: 27.3,13.22 27.3,14.45 23.18,14.45 R7.2
  Top 0.203: IC5.3 27.3,13.22
  Top 0.762: 27.3,13.22 C13.1 27.3,12.04
N$35
  Top 0.203: 27.3,18.81 IC5.1 | C14.2 27.3,20
  Top 0.762: 27.3,20 27.3,18.81
N$36
  Top 0.356: ATT2.1 16.31,6.11
  Top 1.143: J2.1 16.31,6.11
N$113  (via drill 0.33)
  other vias: 11.99,3.03

### Text on the board
tPlace: HMC476 | HMC476 | HMC431 | Power | Tx Out | VCO | HMC476 | Rx In | VCO | EN | MOD | HMC717 | 0-10V | 5V | HMC219 | GND | IF Out
tStop: Basic 6 GHz FMCW Radar | Luke Weston, 2014